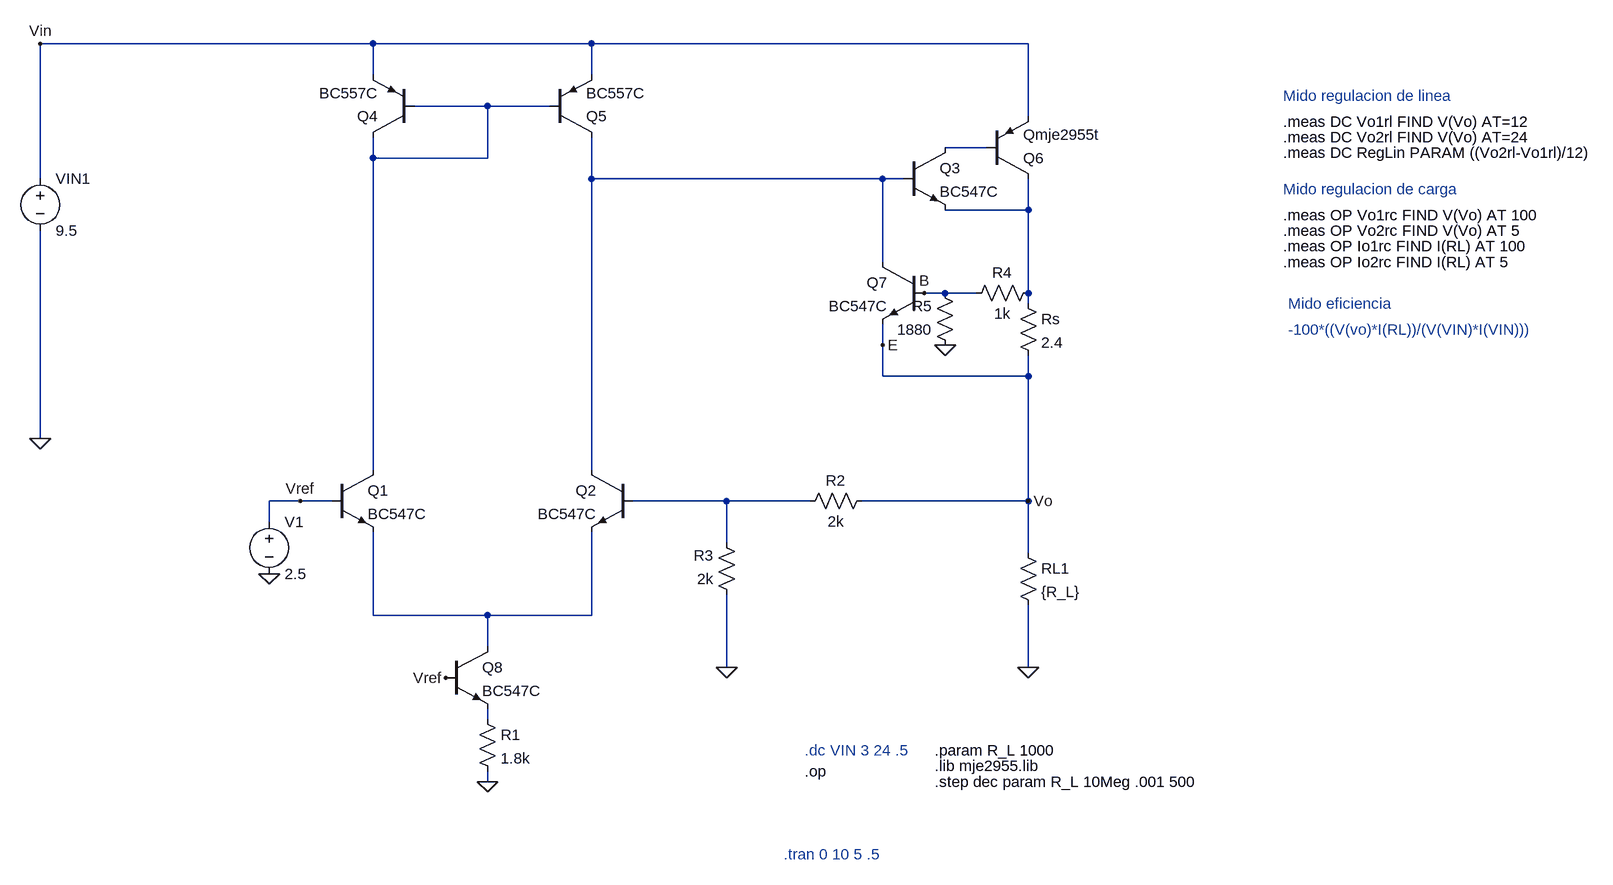
[diagram p0: schematic primer_check_7.asc]
primer_check_7.asc, the LTspice schematic file:
Version 4.1
SHEET 1 1436 992
WIRE -480 -272 -992 -272
WIRE -144 -272 -480 -272
WIRE 528 -272 -144 -272
WIRE -480 -224 -480 -272
WIRE -144 -224 -144 -272
WIRE -304 -176 -416 -176
WIRE -208 -176 -304 -176
WIRE 528 -160 528 -272
WIRE 464 -112 400 -112
WIRE -480 -96 -480 -128
WIRE -304 -96 -304 -176
WIRE -304 -96 -480 -96
WIRE -992 -64 -992 -272
WIRE -144 -64 -144 -128
WIRE 304 -64 -144 -64
WIRE 336 -64 304 -64
WIRE 528 -16 528 -64
WIRE 528 -16 400 -16
WIRE 304 64 304 -64
WIRE 400 112 368 112
WIRE 448 112 400 112
WIRE 528 112 528 -16
WIRE 528 128 528 112
WIRE 304 192 304 160
WIRE 304 240 304 192
WIRE 528 240 528 208
WIRE 528 240 304 240
WIRE -992 336 -992 16
WIRE -480 384 -480 -96
WIRE -144 384 -144 -64
WIRE -592 432 -640 432
WIRE -544 432 -592 432
WIRE 64 432 -80 432
WIRE 192 432 64 432
WIRE 528 432 528 240
WIRE 528 432 272 432
WIRE -640 464 -640 432
WIRE 64 496 64 432
WIRE 528 512 528 432
WIRE -480 608 -480 480
WIRE -304 608 -480 608
WIRE -144 608 -144 480
WIRE -144 608 -304 608
WIRE -304 656 -304 608
WIRE 64 688 64 576
WIRE 528 688 528 592
WIRE -304 768 -304 752
WIRE -304 864 -304 848
FLAG -640 544 0
FLAG 528 688 0
FLAG -992 336 0
FLAG 64 688 0
FLAG 528 432 Vo
FLAG 400 192 0
FLAG 368 112 B
FLAG 304 192 E
FLAG -592 432 Vref
FLAG -368 704 Vref
FLAG -304 864 0
FLAG -992 -272 Vin
SYMBOL npn -544 384 R0
SYMATTR InstName Q1
SYMATTR Value BC547C
SYMBOL npn -80 384 M0
SYMATTR InstName Q2
SYMATTR Value BC547C
SYMBOL npn 336 -112 R0
SYMATTR InstName Q3
SYMATTR Value BC547C
SYMBOL pnp -416 -128 R180
SYMATTR InstName Q4
SYMATTR Value BC557C
SYMBOL pnp -208 -128 M180
SYMATTR InstName Q5
SYMATTR Value BC557C
SYMBOL voltage -640 448 R0
WINDOW 123 0 0 Left 0
WINDOW 39 0 0 Left 0
SYMATTR InstName V1
SYMATTR Value 2.5
SYMBOL voltage -992 -80 R0
WINDOW 123 0 0 Left 0
WINDOW 39 0 0 Left 0
SYMATTR InstName VIN1
SYMATTR Value 9.5
SYMBOL pnp 464 -64 M180
SYMATTR InstName Q6
SYMATTR Value Qmje2955t
SYMBOL res 512 496 R0
SYMATTR InstName RL1
SYMATTR Value {R_L}
SYMBOL res 288 416 R90
WINDOW 0 0 56 VBottom 2
WINDOW 3 32 56 VTop 2
SYMATTR InstName R2
SYMATTR Value 2k
SYMBOL res 80 592 R180
WINDOW 0 36 76 Left 2
WINDOW 3 36 40 Left 2
SYMATTR InstName R3
SYMATTR Value 2k
SYMBOL npn 368 64 M0
SYMATTR InstName Q7
SYMATTR Value BC547C
SYMBOL res 512 112 R0
SYMATTR InstName Rs
SYMATTR Value 2.4
SYMBOL res 544 96 R90
WINDOW 0 0 56 VBottom 2
WINDOW 3 32 56 VTop 2
SYMATTR InstName R4
SYMATTR Value 1k
SYMBOL res 416 208 R180
WINDOW 0 36 76 Left 2
WINDOW 3 36 40 Left 2
SYMATTR InstName R5
SYMATTR Value 1880
SYMBOL npn -368 656 R0
SYMATTR InstName Q8
SYMATTR Value BC547C
SYMBOL res -320 752 R0
SYMATTR InstName R1
SYMATTR Value 1.8k
TEXT 384 816 Left 2 !.param R_L 1000
TEXT 384 840 Left 2 !.lib mje2955.lib
TEXT 184 816 Left 2 ;.dc VIN 3 24 .5
TEXT 384 864 Left 2 !.step dec param R_L 10Meg .001 500
TEXT 184 848 Left 2 !.op
TEXT 920 -192 Left 2 ;Mido regulacion de linea
TEXT 920 -152 Left 2 !.meas DC Vo1rl FIND V(Vo) AT=12
TEXT 920 -128 Left 2 !.meas DC Vo2rl FIND V(Vo) AT=24
TEXT 920 -104 Left 2 !.meas DC RegLin PARAM ((Vo2rl-Vo1rl)/12)
TEXT 920 -48 Left 2 ;Mido regulacion de carga
TEXT 920 -8 Left 2 !.meas OP Vo1rc FIND V(Vo) AT 100
TEXT 920 16 Left 2 !.meas OP Vo2rc FIND V(Vo) AT 5
TEXT 920 40 Left 2 !.meas OP Io1rc FIND I(RL) AT 100
TEXT 920 64 Left 2 !.meas OP Io2rc FIND I(RL) AT 5
TEXT 928 128 Left 2 ;Mido eficiencia
TEXT 928 168 Left 2 ;-100*((V(vo)*I(RL))/(V(VIN)*I(VIN)))
TEXT 152 976 Left 2 ;.tran 0 10 5 .5

The netlist it stands for:
* primer_check_7.asc
Q1 N001 Vref N006 0 BC547C
Q2 N003 N005 N006 0 BC547C
Q3 N002 N003 N004 0 BC547C
Q4 N001 N001 Vin 0 BC557C
Q5 N003 N001 Vin 0 BC557C
V1 Vref 0 2.5
VIN1 Vin 0 9.5
Q6 N004 N002 Vin 0 Qmje2955t
RL1 E 0 {R_L}
R2 E N005 2k
R3 0 N005 2k
Q7 N003 B E 0 BC547C
Rs N004 E 2.4
R4 N004 B 1k
R5 0 B 1880
Q8 N006 Vref N007 0 BC547C
R1 N007 0 1.8k
.model NPN NPN
.model PNP PNP
.lib standard.bjt
.param R_L 1000
.lib mje2955.lib
* .dc VIN 3 24 .5
.step dec param R_L 10Meg .001 500
.op
* Mido regulacion de linea
.meas DC Vo1rl FIND V(Vo) AT=12
.meas DC Vo2rl FIND V(Vo) AT=24
.meas DC RegLin PARAM ((Vo2rl-Vo1rl)/12)
* Mido regulacion de carga
.meas OP Vo1rc FIND V(Vo) AT 100
.meas OP Vo2rc FIND V(Vo) AT 5
.meas OP Io1rc FIND I(RL) AT 100
.meas OP Io2rc FIND I(RL) AT 5
* Mido eficiencia
* -100*((V(vo)*I(RL))/(V(VIN)*I(VIN)))
* .tran 0 10 5 .5
.backanno
.end